# EAGLE schematic Motherboard (EAGLE 9.6.2)
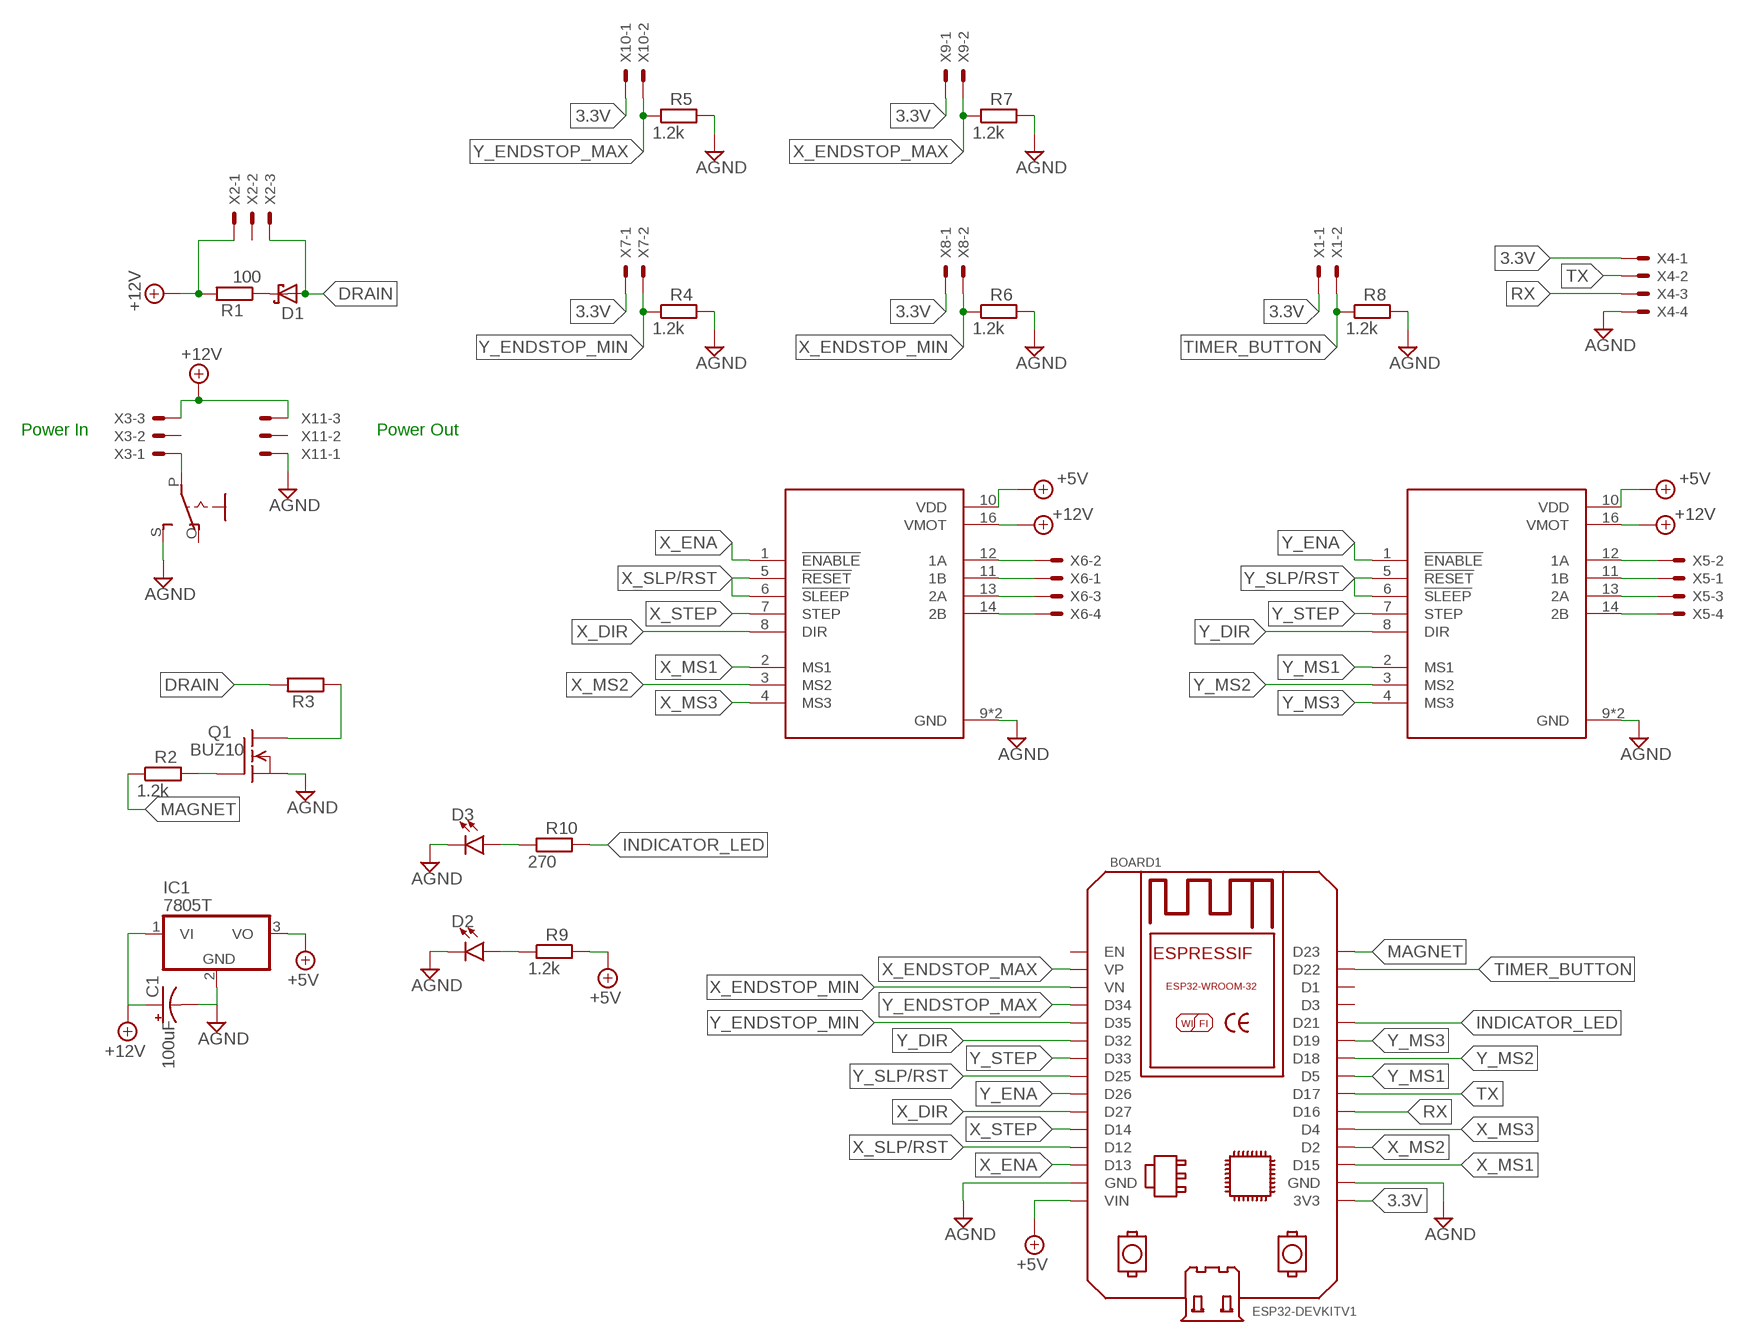
[diagram p0: schematic, sheet 1]

## Parts
BOARD1  ESP32DEVKITV1  [ESP32-DEVKITV1]
C1  100uF  CPOL-USB45181A  [B45181A]
D1  SCHOTTKY-DIODEDO41  [DO41-10]
D2  LED0603  [LED-0603]
D3  LED0603  [LED-0603]
IC1  7805T  [TO220H]
Q1  BUZ10  [TO220]
R1  100  R-EU_R0603  [R0603]
R2  1.2k  R-EU_R0603  [R0603]
R3  R-EU_R0603  [R0603]
R4  1.2k  R-EU_R0603  [R0603]
R5  1.2k  R-EU_R0603  [R0603]
R6  1.2k  R-EU_R0603  [R0603]
R7  1.2k  R-EU_R0603  [R0603]
R8  1.2k  R-EU_R0603  [R0603]
R9  1.2k  R-EU_R0603  [R0603]
R10  270  R-EU_R0603  [R0603]
S1  EG1218S  [EG1218]
U1  A4988_STEPPER_MOTOR_DRIVER_CARRIER  [MODULE_A4988_STEPPER_MOTOR_DRIVER_CARRIER]
U2  A4988_STEPPER_MOTOR_DRIVER_CARRIER  [MODULE_A4988_STEPPER_MOTOR_DRIVER_CARRIER]
X1  22-23-2021  [22-23-2021]
X2  22-23-2031  [22-23-2031]
X3  22-23-2031  [22-23-2031]
X4  22-23-2041  [22-23-2041]
X5  22-23-2041  [22-23-2041]
X6  22-23-2041  [22-23-2041]
X7  22-23-2021  [22-23-2021]
X8  22-23-2021  [22-23-2021]
X9  22-23-2021  [22-23-2021]
X10  22-23-2021  [22-23-2021]
X11  22-23-2031  [22-23-2031]

## Nets
3.3V: BOARD1.3V3 X1.1 X4.1 X7.1 X8.1 X9.1 X10.1
+5V: BOARD1.VIN IC1.3(VO) R9.2 U1.10(VDD) U2.10(VDD)
+12V: C1.+ IC1.1(VI) R1.2 U1.16(VMOT) U2.16(VMOT) X2.1 X3.3 X11.3
AGND: BOARD1.GND BOARD1.GND@1(GND) C1.- D2.C D3.C IC1.2(GND) Q1.3(S) R4.2 R5.2 R6.2 R7.2 R8.2 S1.S U1.9(GND) U1.15(GND) U2.9(GND) U2.15(GND) X4.4 X11.1
DRAIN: D1.A R3.2 X2.3
INDICATOR_LED: BOARD1.D21 R10.2
MAGNET: BOARD1.D23 R2.1
N$1: U2.12(1A) X5.2
N$2: U2.11(1B) X5.1
N$3: U2.13(2A) X5.3
N$4: U2.14(2B) X5.4
N$5: U1.12(1A) X6.2
N$6: U1.11(1B) X6.1
N$7: D2.A R9.1
N$8: D3.A R10.1
N$9: Q1.2(D) R3.1
N$10: Q1.1(G) R2.2
N$12: D1.C R1.1
N$13: S1.P X3.1
N$22: U1.13(2A) X6.3
N$23: U1.14(2B) X6.4
RX: BOARD1.D16 X4.3
TIMER_BUTTON: BOARD1.D22 R8.1 X1.2
TX: BOARD1.D17 X4.2
X_DIR: BOARD1.D27 U1.8(DIR)
X_ENA: BOARD1.D13 U1.1(!ENABLE)
X_ENDSTOP_MAX: BOARD1.VP R7.1 X9.2
X_ENDSTOP_MIN: BOARD1.VN R6.1 X8.2
X_MS1: BOARD1.D15 U1.2(MS1)
X_MS2: BOARD1.D2 U1.3(MS2)
X_MS3: BOARD1.D4 U1.4(MS3)
X_SLP/RST: BOARD1.D12 U1.5(!RESET) U1.6(!SLEEP)
X_STEP: BOARD1.D14 U1.7(STEP)
Y_DIR: BOARD1.D32 U2.8(DIR)
Y_ENA: BOARD1.D26 U2.1(!ENABLE)
Y_ENDSTOP_MAX: BOARD1.D34 R5.1 X10.2
Y_ENDSTOP_MIN: BOARD1.D35 R4.1 X7.2
Y_MS1: BOARD1.D5 U2.2(MS1)
Y_MS2: BOARD1.D18 U2.3(MS2)
Y_MS3: BOARD1.D19 U2.4(MS3)
Y_SLP/RST: BOARD1.D25 U2.5(!RESET) U2.6(!SLEEP)
Y_STEP: BOARD1.D33 U2.7(STEP)
Unconnected: BOARD1.D1 BOARD1.D3 BOARD1.EN S1.O X2.2 X3.2 X11.2

## Notes on the sheet
- Power In | Power Out

## Library data of the parts
BOARD1 = ESP32-DEVKITV1:ESP32DEVKITV1: https://github.com/shridattdudhat
C1 = rcl:CPOL-US: POLARIZED CAPACITOR, American symbol; SPICEPREFIX: C
D1 = adafruit:SCHOTTKY-DIODE: Schottky Diode
D2 D3 = SparkFun-LED:LED: LED (Generic) Standard schematic elements and footprints for 5mm, 3mm, 1206, and 0603 sized LEDs. Generic LEDs with no color specified.
IC1 = linear:78*: Positive VOLTAGE REGULATOR Source: http://cache.national.com/ds/LM/LM78L05.pdf http://www.fairchildsemi.com/ds/LM/LM7805.pdf
Q1 = transistor-fet:BUZ10: N-Channel Enhancement MOSFET 50V; 20A; 0,080Ohm
R1-R10 = rcl:R-EU_: RESISTOR, European symbol; SPICEPREFIX: R
S1 = adafruit:EG1218: SLIDING SWITCH 0.1" spacing through hole, vertical SPDT slide switch http://www.ladyada.net/library/pcb/eaglelibrary.html
U1 U2 = A4988_STEPPER_MOTOR_DRIVER_CARRIER:A4988_STEPPER_MOTOR_DRIVER_CARRIER: Stepper motor controler; IC: A4988; 1A; Uin mot: 8÷35V Check availability <https://pricing.snapeda.com/parts/A4988%20STEPPER%20MOTOR%20DRIVER%20CARRIER/Pololu/view-part?ref=eda>; AVAILABILITY: Not in stock; DESCRIPTION: Stepper Motor Driver; MF: Pololu; MP: A4988 STEPPER MOTOR DRIVER CARRIER; PACKAGE: None; PRICE: None
X1 X7-X10 = con-molex:22-23-2021: .100" (2.54mm) Center Header - 2 Pin; MF: MOLEX; MPN: 22-23-2021; OC_FARNELL: 1462926; OC_NEWARK: 25C3832
X2 X3 X11 = con-molex:22-23-2031: .100" (2.54mm) Center Header - 3 Pin; MF: MOLEX; MPN: 22-23-2031; OC_FARNELL: 1462950; OC_NEWARK: 30C0862
X4-X6 = con-molex:22-23-2041: .100" (2.54mm) Center Header - 4 Pin; MF: MOLEX; MPN: 22-23-2041; OC_FARNELL: 1462920; OC_NEWARK: 38C0355